# EAGLE design MS6205-Arduino (EAGLE 9.6.2)
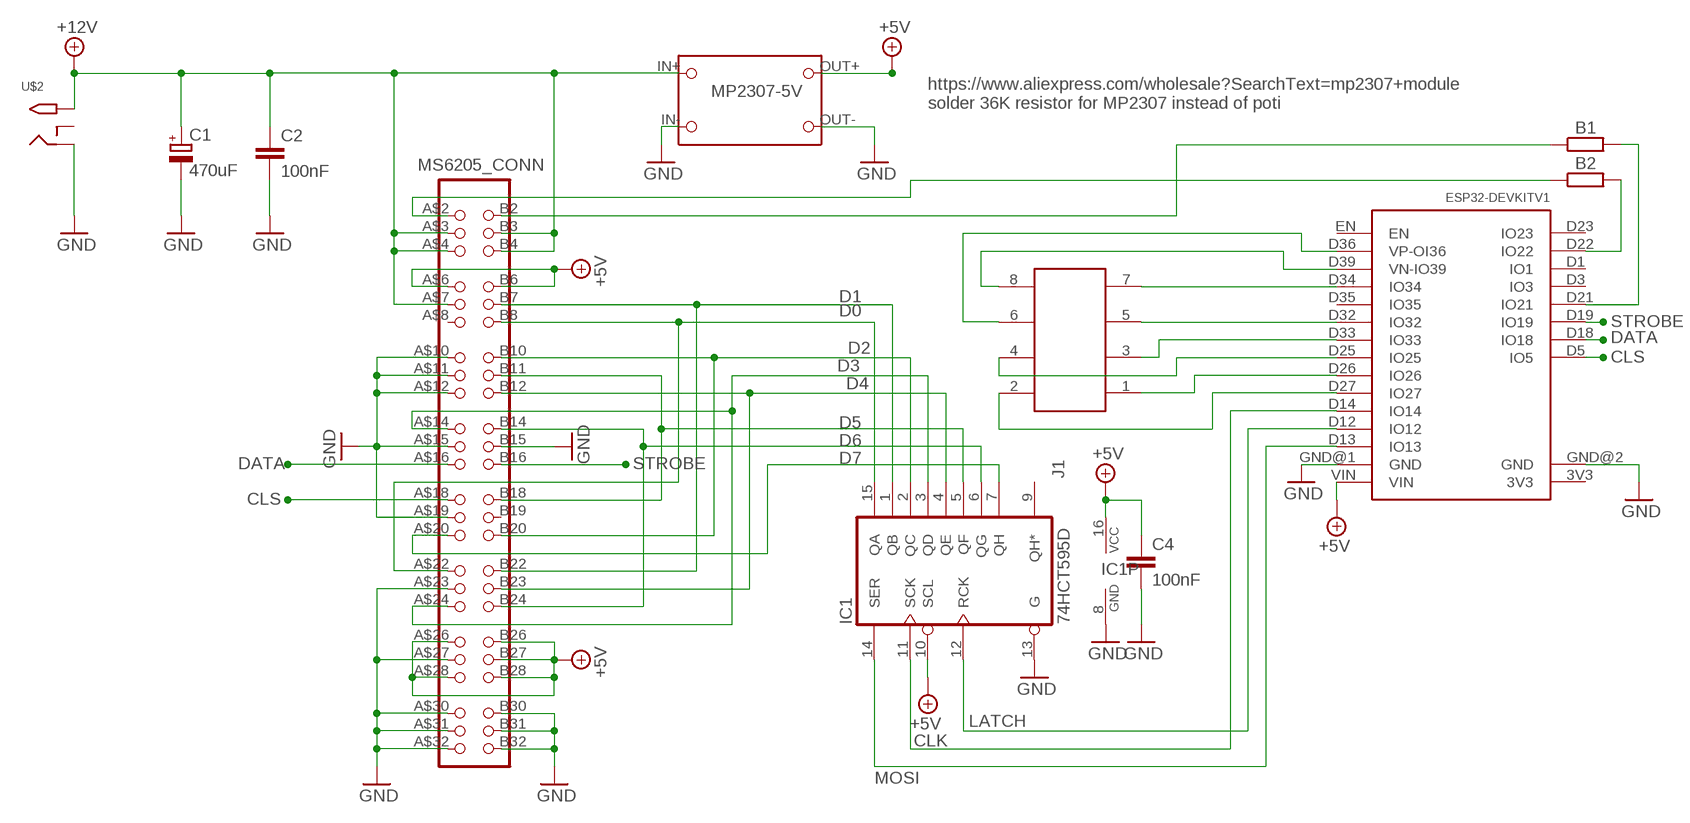
[diagram p0: schematic, sheet 1]

## Parts
B1  0  R-EU_0204/5  [0204/5]
B2  0  R-EU_0204/5  [0204/5]
C1  470uF  CPOL-EU150CLZ-1010  [150CLZ-1010]
C2  100nF  C-EUC0805  [C0805]
C4  100nF  C-EUC0805  [C0805]
IC1  74HCT595D  [SO16]
J1  61200822323  [61200822323]
MP2307-5V  PWS-MP2307  [MP2307-PWS]
U$1  ESP32DEVKIT1-REDUCED  [ESP32-DEVKIT1-REDUCED]
U$2  2.1MMJACKTHM  [PJ-102A]
U$4  MS6205_CONN  MS6205-CONNECTOR  [MS6205_CONNECTOR_SMD]

## Nets
+12V: C1.+ C2.1 MP2307-5V.IN+ U$2.TIP U$4.A$3(A3) U$4.A$4(A4) U$4.A$7(A7) U$4.B3 U$4.B4
CLK: IC1.11(SCK) U$1.D14(IO14)
CLS: U$1.D5(IO5) U$4.A$18(A18)
D0: IC1.15(QA) U$4.A$22(A22) U$4.B8
D1: IC1.1(QB) U$4.B7 U$4.B22
D2: IC1.2(QC) U$4.B10 U$4.B20
D3: IC1.3(QD) U$4.A$14(A14) U$4.A$24(A24)
D4: IC1.4(QE) U$4.B12 U$4.B23
D5: IC1.5(QF) U$4.B11 U$4.B18
D6: IC1.6(QG) U$4.B14 U$4.B24
D7: IC1.7(QH) U$4.A$20(A20)
DATA: U$1.D18(IO18) U$4.A$16(A16)
GND: C1.- C2.2 C4.2 IC1.8(GND) IC1.13(G) MP2307-5V.IN- MP2307-5V.OUT- U$1.GND@1(GND) U$1.GND@2(GND) U$2.RING U$4.A$10(A10) U$4.A$11(A11) U$4.A$12(A12) U$4.A$15(A15) U$4.A$19(A19) U$4.A$23(A23) U$4.A$27(A27) U$4.A$30(A30) U$4.A$31(A31) U$4.A$32(A32) U$4.B15 U$4.B30 U$4.B31 U$4.B32
LATCH: IC1.12(RCK) U$1.D12(IO12)
MOSI: IC1.14(SER) U$1.D13(IO13)
N$1: B1.1 U$4.B2
N$2: B2.1 U$4.A$2(A2)
N$3: B1.2 U$1.D21(IO21)
N$4: B2.2 U$1.D22(IO22)
N$5: J1.2 U$1.D27(IO27)
N$6: J1.1 U$1.D26(IO26)
N$7: J1.4 U$1.D25(IO25)
N$8: J1.3 U$1.D33(IO33)
N$9: J1.5 U$1.D32(IO32)
N$10: J1.7 U$1.D34(IO34)
N$11: J1.8 U$1.D39(VN-IO39)
N$12: J1.6 U$1.D36(VP-OI36)
STROBE: U$1.D19(IO19) U$4.B16
VCC: C4.1 IC1.10(SCL) IC1.16(VCC) MP2307-5V.OUT+ U$1.VIN U$4.A$6(A6) U$4.A$26(A26) U$4.A$28(A28) U$4.B6 U$4.B26 U$4.B27 U$4.B28 ; supply symbol labelled +5V
Unconnected: IC1.9(QH*) U$1.3V3 U$1.D1(IO1) U$1.D3(IO3) U$1.D23(IO23) U$1.D35(IO35) U$1.EN U$2.RING_SW U$4.A$8(A8) U$4.B19

## Notes on the sheet
- https://www.aliexpress.com/wholesale?SearchText=mp2307+module
  solder 36K resistor for MP2307 instead of poti

## Library data of the parts
B1 B2 = rcl:R-EU_: RESISTOR, European symbol; SPICEPREFIX: R
C1 = rcl:CPOL-EU: POLARIZED CAPACITOR, European symbol; SPICEPREFIX: C
C2 C4 = rcl:C-EU: CAPACITOR, European symbol; SPICEPREFIX: C
IC1 = 74xx-eu:74*595: 8-bit SHIFT REGISTER, output latch
J1 = Wurth_Elektronik_Electromechanic_Wire_to_Board_Connectors_rev19a:61200822323: WR-BHD 2.54mm Board to Cable Transition Connector, 8 Pins=>Code : Con_WTB_IDC_61200822323 <http://katalog.we-online.de/media/thumbs2/eican/thb_Con_WTB_IDC_6120xx22323_pf2.jpg> Details see: http://katalog.we-online.de/en/em/612_0xx_223_23 Created 2014-06-05, Karrer Zheng 2014 (C) Würth Elektronik
MP2307-5V = MS6205_Display:PWS-MP2307
U$1 = ESP32-DEVKITV1:ESP32DEVKIT1-REDUCED; SPICEPREFIX: X
U$2 = adafruit:2.1MMJACK: 2.1mm x 5.5mm THM DC jack with internal switch. Digikey part #PJ-102A, 4UCON part #05537 2.1mm x 5.5mm SMT DC jack with internal switch. Digikey part #PJ-002A-SMT, 4UCON part #03267 By microbuilder.eu & adafruit.com
U$4 = MS6205_Display:MS6205-CONNECTOR

## Board
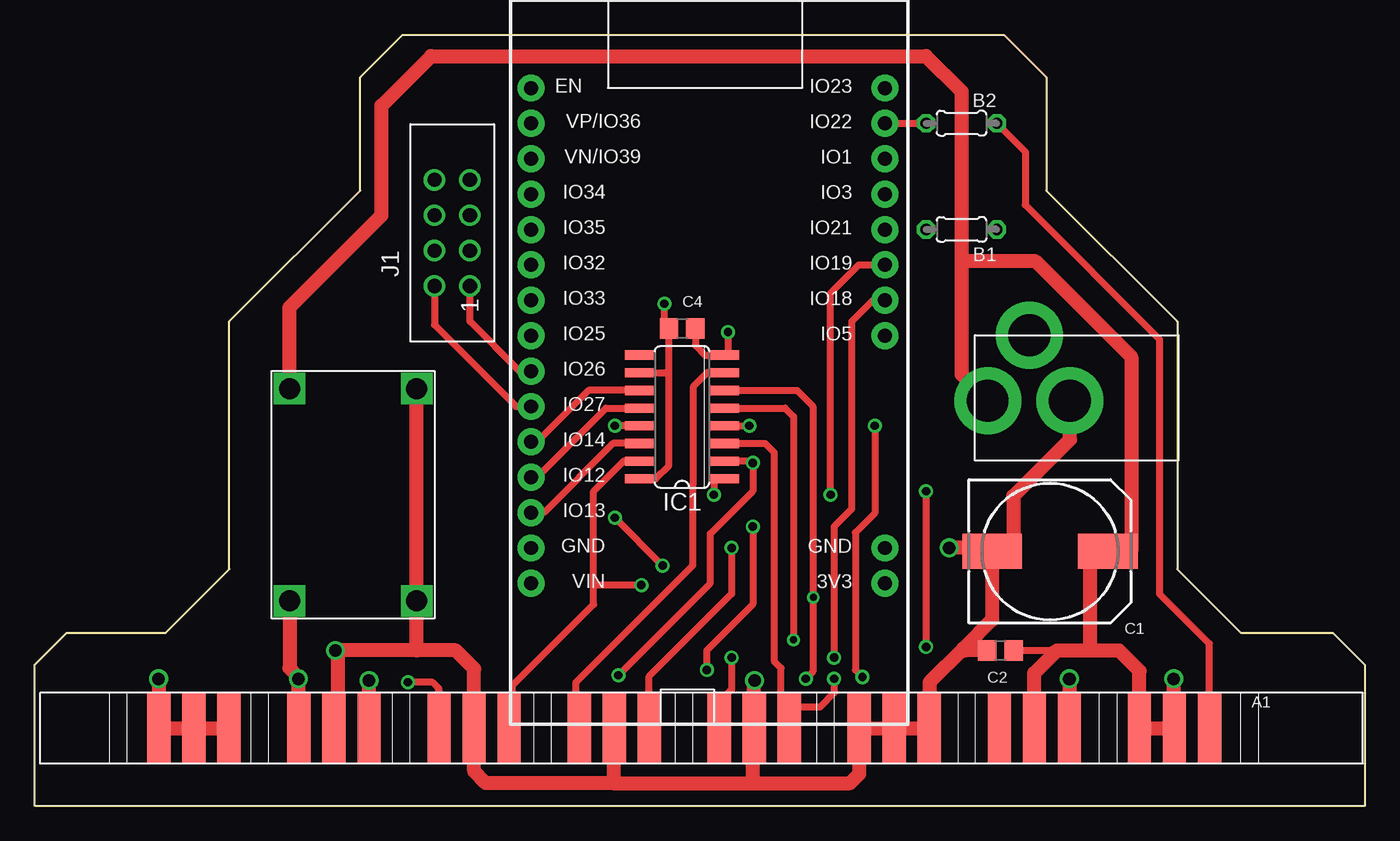
[diagram p1: board, top side]
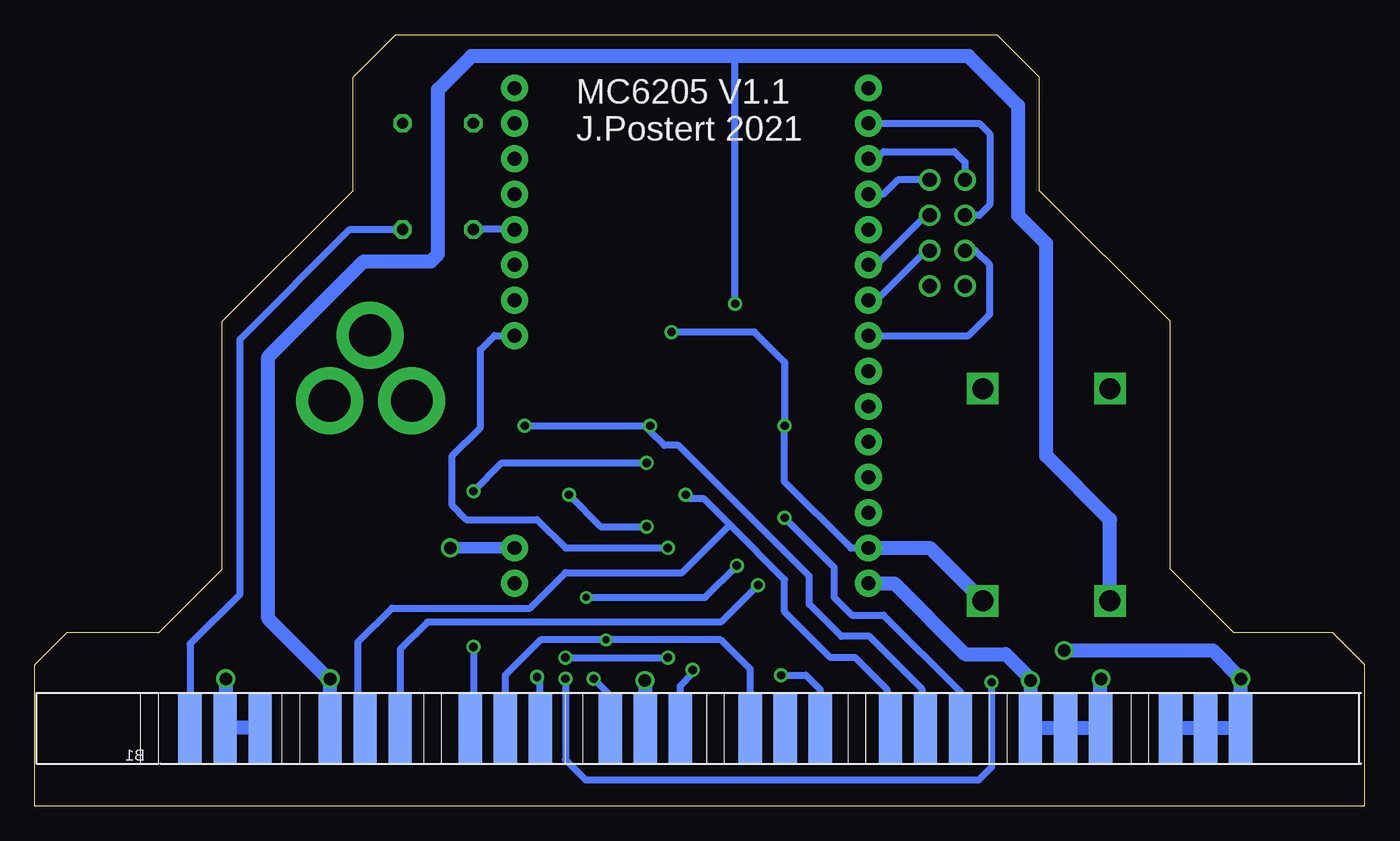
[diagram p2: board, bottom side, seen from below]

Size 95.5 x 55.37 mm. Coordinates in mm from the lower left corner, seen from the top.
Outline: 9.4,12.45 13.97,17.02 13.97,34.8 23.37,44.2 23.37,52.32 26.42,55.37 69.6,55.37 72.64,52.32 72.64,44.2 82.04,34.8 82.04,17.02 86.61,12.45 93.22,12.45 95.5,10.16 95.5,0 0,0 0,10.16 2.29,12.45 9.4,12.45
Copper layers (1*16): Top 0.035mm / dielectric 1.5mm / Bottom 0.035mm
Design rules "default *": minimum track width 6mil, minimum drill 0.35mm, track to track 6mil, track to pad 6mil, pad to pad 6mil, via to via 6mil, smd to smd 6mil, copper to edge 40mil, drill to drill 6mil, minimum pad ring 10mil, minimum via ring 8mil, stop-mask expansion 4mil, vias tented up to drill 0mil, thermal gap 10mil

### Footprints (pad centres in the part's own frame; a part is rotated, then mirrored left to right if it is on the bottom)
0204/5 = drill 0.813 octagon: 1 -2.54,0; 2 2.54,0
150CLZ-1010 = smd 4.3 x 2.5: + 4.15,0; - -4.15,0
C0805 = smd 1.3 x 1.5: 1 -0.95,0; 2 0.95,0
SO16 = smd 0.66 x 2.032: 1 -4.445,-3.073; 2 -3.175,-3.073; 3 -1.905,-3.073; 4 -0.635,-3.073; 5 0.635,-3.073; 6 1.905,-3.073; 7 3.175,-3.073; 8 4.445,-3.073; 9 4.445,3.073; 10 3.175,3.073; 11 1.905,3.073; 12 0.635,3.073; 13 -0.635,3.073; 14 -1.905,3.073; 15 -3.175,3.073; 16 -4.445,3.073
61200822323 = drill 1.02: 1 -2.54,-1.27; 2 -2.54,1.27; 3 0,-1.27; 4 0,1.27; 5 2.54,-1.27; 6 2.54,1.27; 7 5.08,-1.27; 8 5.08,1.27
MP2307-PWS = drill 1.5 square: IN+ -7.62,-3.81; IN- -7.62,5.334; OUT+ 7.62,-3.81; OUT- 7.62,5.334
ESP32-DEVKIT1-REDUCED = drill 1 pad 1.93: 3V3 -15.25,-12.27; D1 15.23,-12.27; D3 12.69,-12.27; D5 2.53,-12.27; D12 -7.63,13.135; D13 -10.17,13.135; D14 -5.09,13.135; D18 5.07,-12.27; D19 7.61,-12.27; D21 10.15,-12.27; D22 17.77,-12.27; D23 20.31,-12.27; D25 2.53,13.135; D26 -0.01,13.135; D27 -2.55,13.135; D32 7.61,13.135; D33 5.07,13.135; D34 12.69,13.135; D35 10.15,13.135; D36 17.77,13.135; D39 15.23,13.135; EN 20.31,13.135; GND@1 -12.71,13.135; GND@2 -12.71,-12.27; VIN -15.25,13.135
PJ-102A = drill 3 pad 4.8: RING 0.1,-3.39; RING_SW -4.6,-6.29; TIP 0.1,-9.29
MS6205_CONNECTOR_SMD = smd 1.676 x 5.08: A$2 11.151,2.54; A$3 13.665,2.54; A$4 16.18,2.54; A$6 21.209,2.54; A$7 23.724,2.54; A$8 26.238,2.54; A$10 31.267,2.54; A$11 33.782,2.54; A$12 36.297,2.54; A$14 41.326,2.54; A$15 43.84,2.54; A$16 46.355,2.54; A$18 51.384,2.54; A$19 53.899,2.54; A$20 56.413,2.54; A$22 61.443,2.54; A$23 63.957,2.54; A$24 66.472,2.54; A$26 71.501,2.54; A$27 74.016,2.54; A$28 76.53,2.54; A$30 81.559,2.54; A$31 84.074,2.54; A$32 86.589,2.54 | smd 1.676 x 5.08 bottom: B2 11.151,2.54; B3 13.665,2.54; B4 16.18,2.54; B6 21.209,2.54; B7 23.724,2.54; B8 26.238,2.54; B10 31.267,2.54; B11 33.782,2.54; B12 36.297,2.54; B14 41.326,2.54; B15 43.84,2.54; B16 46.355,2.54; B18 51.384,2.54; B19 53.899,2.54; B20 56.413,2.54; B22 61.443,2.54; B23 63.957,2.54; B24 66.472,2.54; B26 71.501,2.54; B27 74.016,2.54; B28 76.53,2.54; B30 81.559,2.54; B31 84.074,2.54; B32 86.589,2.54

### Placement (x,y rotation side)
B1  66.55,41.4 180 top
B2  66.55,49.02 180 top
C1  72.9,18.29 0 top
C2  69.34,11.18 180 top
C4  46.48,34.29 0 top
IC1  46.48,27.94 90 top
J1  29.97,39.88 90 top
MP2307-5V  22.1,22.35 270 top
U$1  48.77,31.24 90 top
U$2  77.72,29.21 270 top
U$4  95.5,8.13 180 top

### Tracks (layer width: path | path; a pad name or v marks a point on that pad's centre or on a via)
+12V  (via drill 0.9)
  Top 0.508: C2.1 72.9,11.18 73.15,10.92
  Top 1.016: v81.79,9.14 81.79,5.64 U$4.A$3 U$4.A$4 79.32,9.7 77.85,11.18 75.77,11.18 | 66.55,39.12 71.88,39.12 78.74,32.26 78.74,18.29 C1.+ 75.77,18.29 75.77,11.18 | U$4.A$7 71.78,9.55 73.15,10.92 73.41,11.18 75.77,11.18 | 66.55,39.12 66.55,51.31 64.01,53.85 28.45,53.85 24.89,50.29 24.89,42.42 18.29,35.81 MP2307-5V.IN+ | 66.55,39.12 66.55,31 U$2.TIP
  Bottom 1.016: 81.79,5.64 U$4.A$3 | v81.79,9.14 81.79,5.64 | U$4.A$4 79.38,5.64 81.79,5.64
CLK
  Top 0.508: IC1.11 39.75,29.84 36.06,26.15 U$1.D14
CLS  (via drill 0.6)
  Top 0.508: U$4.A$18 44.12,9.32 50.04,15.24 v50.04,18.54
  Bottom 0.508: v50.04,18.54 57.4,18.54 59.44,20.57 64.52,20.57 65.53,21.59 65.53,25.15 63.5,27.18 63.5,32.77 62.49,33.77 U$1.D5
D0  (via drill 0.6)
  Top 0.508: IC1.15 42.29,24.77 40.13,22.61 40.13,15.88 | U$4.A$22 34.31,5.84 34.31,8.66 40.13,14.48 40.13,15.88 | v43.56,15.88 40.13,15.88
  Bottom 0.508: v43.56,15.88 46.23,13.21 67.31,13.21 69.27,11.25 U$4.B8
D1  (via drill 0.6)
  Top 0.508: IC1.1 48.77,23.5 v48.77,22.35
  Bottom 0.508: v48.77,22.35 48.51,22.1 47.5,22.1 45.59,20.19 | U$4.B7 72.29,6.1 72.29,11.79 69.85,14.22 59.94,14.22 57.4,16.76 49.02,16.76 45.59,20.19 | U$4.B22 34.31,5.84 34.31,8.41 36.58,10.67 38.35,10.67 41.66,13.97 41.66,16.26 45.59,20.19
D2  (via drill 0.6)
  Top 0.508: IC1.2 51.44,24.77 v51.56,24.64 51.56,22.61 48.51,19.56 48.51,16 v41.91,9.4 | v64.01,22.61 v64.01,11.43
  Bottom 0.508: v51.56,24.64 61.98,24.64 v64.01,22.61 | v41.91,9.4 40.13,9.4 39.12,8.38 39.12,5.61 U$4.B20 | U$4.B10 63.98,5.84 63.98,11.43 v64.01,11.43
D3  (via drill 0.6)
  Top 0.508: IC1.3 52.45,26.04 53.09,25.4 53.09,10.41 53.59,9.91 53.59,6.17 U$4.A$14 54.18,7.11 56.39,7.11 57.4,8.13 v57.4,9.14 | U$4.A$24 29.03,8.43 28.57,8.89 v26.8,8.89
  Bottom 0.508: v57.4,9.14 57.4,3.34 55.95,1.88 27.71,1.88 26.8,2.79 v26.8,8.89
D4  (via drill 0.6)
  Top 0.508: IC1.4 v51.31,27.3 | v59.44,9.27 58.93,9.78 58.93,19.63 60.33,21.03 v60.33,27.3
  Bottom 0.508: v60.33,27.3 v51.31,27.3 51.31,26.92 50.29,25.91 49.28,25.91 39.88,16.51 39.88,14.48 37.59,12.19 35.56,12.19 31.8,8.43 31.8,5.84 U$4.B23 | U$4.B12 59.21,9.04 v59.44,9.27
D5  (via drill 0.5)
  Top 0.508: IC1.5 53.87,28.57 54.48,27.96 v54.48,11.94
  Bottom 0.508: U$4.B18 44.12,9.83 46.23,11.94 v54.48,11.94 59.18,11.94 61.72,9.4 U$4.B11
D6  (via drill 0.5, 0.6)
  Top 0.508: IC1.6 54.74,29.84 55.88,28.7 55.88,14.99 | 55.88,14.99 v55.91,14.99 | v45.09,17.27 v41.66,20.7 | v55.37,9.14 55.88,9.65 55.88,14.99
  Bottom 0.508: U$4.B14 54.18,7.95 v55.37,9.14 | v55.91,14.99 47.37,14.99 v45.09,17.27 | v41.66,20.7 38.1,17.14 38.1,14.99 36.83,13.72 34.54,13.72 29.03,8.2 U$4.B24
D7
  Top 0.508: U$4.A$20 38.84,5.84 38.84,8.87 47.24,17.27 47.24,23.11 47.27,23.14 47.27,30.1 48.28,31.11 IC1.7
DATA  (via drill 0.6)
  Top 0.508: v57.4,10.67 57.4,20.07 58.67,21.34 58.67,34.8 60.2,36.32 61.03,36.32 U$1.D18 | U$4.A$16 49.66,6.1 49.66,8 50.04,8.38 v50.04,10.67
  Bottom 0.508: v57.4,10.67 v50.04,10.67
GND  (via drill 0.6, 0.9)
  Top 0.508: C4.2 47.43,33.09 48.13,32.38 IC1.8 49.78,32.61 v49.78,34.04 | IC1.13 v41.66,27.3
  Top 1.016: U$4.A$30 U$4.B31 U$4.B32 8.91,9.12 v8.89,9.14 | U$4.A$27 21.74,5.84 21.74,11.02 v21.59,11.18 27.43,11.18 | 41.53,1.65 32.38,1.65 31.55,2.49 U$4.A$23 31.55,9.86 30.23,11.18 27.43,11.18 | U$4.A$19 41.6,1.73 41.53,1.65 | 41.53,1.65 51.56,1.65 | 51.56,1.65 51.56,4.83 51.31,5.08 51.31,5.23 U$4.B15 51.66,8.99 v51.69,9.02 | 51.56,1.65 58.55,1.65 59.21,2.31 U$4.A$12 U$4.A$11 U$4.A$10 64.26,5.61 64.26,8.89 66.67,11.3 | v65.66,18.54 68.49,18.54 C1.- | U$2.RING 74.33,26.32 70.27,22.25 70.27,19.05 69.51,18.29 C1.- | 27.43,11.18 MP2307-5V.OUT- MP2307-5V.IN- | C1.- 68.75,13.38 66.67,11.3 | C2.2 66.8,11.18 66.67,11.3
  Bottom 0.508: U$1.GND@1 35.81,18.53 36.9,18.53 41.66,23.29 v41.66,27.3 41.66,31.88 43.81,34.04 v49.78,34.04
  Bottom 0.813: U$1.GND@2 v65.65,18.53 v65.66,18.54
  Bottom 1.016: U$4.A$30 U$4.B31 U$4.B32 8.91,9.12 v8.89,9.14 10.92,11.18 v21.59,11.18 | v51.69,9.02 51.69,5.61 U$4.B15 | 35.81,18.53 31.23,18.53 MP2307-5V.OUT-
LATCH
  Top 0.508: U$1.D12 36.06,23.61 41.02,28.57 IC1.12
MOSI
  Top 0.508: IC1.14 41.53,26.04 36.57,21.07 U$1.D13
N$1
  Bottom 0.508: U$4.B2 84.35,11.64 80.77,15.22 80.77,33.51 72.88,41.4 B1.1
N$2
  Top 0.508: U$4.A$2 84.35,11.66 80.77,15.24 80.77,33.51 71.12,43.16 71.12,46.99 B2.1
N$3
  Bottom 0.508: U$1.D21 61.05,41.4 B1.2
N$4
  Top 0.508: U$1.D22 61.05,49.02 B2.2
N$5
  Top 0.508: U$1.D27 34.55,28.69 28.7,34.54 J1.2
N$6
  Top 0.508: U$1.D26 34.81,31.23 31.24,34.8 J1.1
N$7
  Bottom 0.508: U$1.D25 28.46,33.77 26.92,35.31 26.92,38.86 27.94,39.88 J1.4
N$8
  Bottom 0.508: U$1.D33 35.06,36.31 31.5,39.88 J1.3
N$9
  Bottom 0.508: U$1.D32 35.06,38.85 31.5,42.42 J1.5
N$10
  Bottom 0.508: U$1.D34 34.55,43.93 33.53,44.96 J1.7
N$11
  Bottom 0.508: U$1.D39 35.06,46.47 34.54,46.99 29.46,46.99 28.7,46.23 J1.8
N$12
  Bottom 0.508: U$1.D36 27.68,49.01 26.92,48.26 26.92,43.18 27.69,42.42 J1.6
STROBE  (via drill 0.6)
  Top 0.508: v48.26,9.78 48.26,11.18 51.56,14.48 v51.56,20.07 | v57.15,22.35 57.15,36.83 59.17,38.85 U$1.D19
  Bottom 0.508: U$4.B16 49.15,8.64 48.26,9.53 v48.26,9.78 | v57.15,22.35 54.86,20.07 v51.56,20.07
VCC  (via drill 0.6, 0.9)
  Top 0.508: IC1.10 45.34,31.11 45.53,31.31 | 45.53,31.31 45.53,24.45 44.58,23.5 IC1.16 | v45.21,36.07 45.21,34.61 C4.1 45.53,31.31
  Top 1.016: U$4.A$28 18.92,5.64 v18.92,9.14 18.92,9.27 18.29,9.91 MP2307-5V.OUT+ | U$4.A$26 v24,9.02 | v74.3,9.14 U$4.B6
  Bottom 0.508: v45.21,36.07 45.21,53.85
  Bottom 1.016: v18.92,9.14 18.97,9.09 U$4.A$28 U$4.B27 U$4.A$26 v24,9.02 23.94,9.08 25.78,10.92 28.7,10.92 33.77,15.99 U$1.VIN | U$4.B6 v74.3,9.14 74.42,9.14 78.74,13.46 78.74,32.26 71.88,39.12 67.06,39.12 66.55,39.62 66.55,51.44 64.14,53.85 45.21,53.85 28.45,53.85 24.89,50.29 24.89,42.42 22.86,40.39 22.86,25.15 18.29,20.57 MP2307-5V.OUT+

### Text on the board
bPlace: MC6205 V1.1 / J.Postert 2021
bTestmark: MS6205 Display / V1.0 JPostert 2021